# Altium schematic sheet rs232_conn.SchDoc
size A4
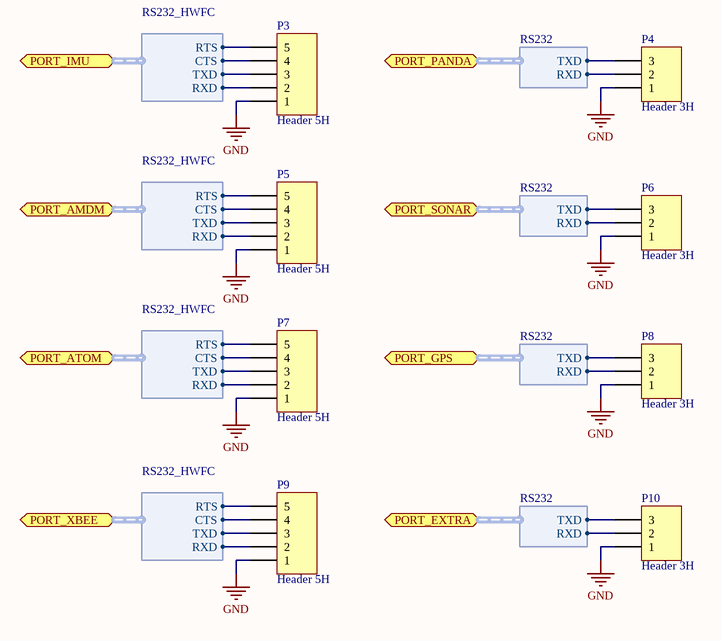
[diagram p0: rs232_conn.SchDoc]

## Parts
P3  Header 5H  [S05B-PASK-2]
P4  Header 3H  [S03B-PASK-2]
P5  Header 5H  [S05B-PASK-2]
P6  Header 3H  [S03B-PASK-2]
P7  Header 5H  [S05B-PASK-2]
P8  Header 3H  [S03B-PASK-2]
P9  Header 5H  [S05B-PASK-2]
P10  Header 3H  [S03B-PASK-2]

## Ports
PORT_AMDM (harness RS232_HWFC), PORT_ATOM (harness RS232_HWFC), PORT_EXTRA (harness RS232), PORT_GPS (harness RS232), PORT_IMU (harness RS232_HWFC), PORT_PANDA (harness RS232), PORT_SONAR (harness RS232), PORT_XBEE (harness RS232_HWFC)

## Harnesses
RS232_HWFC: CTS, RTS, RXD, TXD
RS232: TXD, RXD

## Nets
GND: P3.1 P4.1 P5.1 P6.1 P7.1 P8.1 P9.1 P10.1
NetP3_2: P3.2 ; port PORT_IMU.RXD
NetP3_3: P3.3 ; port PORT_IMU.TXD
NetP3_4: P3.4 ; port PORT_IMU.CTS
NetP3_5: P3.5 ; port PORT_IMU.RTS
NetP4_2: P4.2 ; port PORT_PANDA.RXD
NetP4_3: P4.3 ; port PORT_PANDA.TXD
NetP5_2: P5.2 ; port PORT_AMDM.RXD
NetP5_3: P5.3 ; port PORT_AMDM.TXD
NetP5_4: P5.4 ; port PORT_AMDM.CTS
NetP5_5: P5.5 ; port PORT_AMDM.RTS
NetP6_2: P6.2 ; port PORT_SONAR.RXD
NetP6_3: P6.3 ; port PORT_SONAR.TXD
NetP7_2: P7.2 ; port PORT_ATOM.RXD
NetP7_3: P7.3 ; port PORT_ATOM.TXD
NetP7_4: P7.4 ; port PORT_ATOM.CTS
NetP7_5: P7.5 ; port PORT_ATOM.RTS
NetP8_2: P8.2 ; port PORT_GPS.RXD
NetP8_3: P8.3 ; port PORT_GPS.TXD
NetP9_2: P9.2 ; port PORT_XBEE.RXD
NetP9_3: P9.3 ; port PORT_XBEE.TXD
NetP9_4: P9.4 ; port PORT_XBEE.CTS
NetP9_5: P9.5 ; port PORT_XBEE.RTS
NetP10_2: P10.2 ; port PORT_EXTRA.RXD
NetP10_3: P10.3 ; port PORT_EXTRA.TXD

## Library data of the parts
P3 P5 P7 P9 = Header 5H: Header, 5-Pin, Right Angle; LatestRevisionDate: 17-Jul-2002; LatestRevisionNote: Re-released for DXP Platform.; Publisher: Altium Limited; farnell: 1830750
P4 P6 P8 P10 = Header 3H: Header, 3-Pin, Right Angle; LatestRevisionDate: 17-Jul-2002; LatestRevisionNote: Re-released for DXP Platform.; Publisher: Altium Limited; farnell: 1830748